# Altium project Solar_Panel_top_bot.PrjPcb
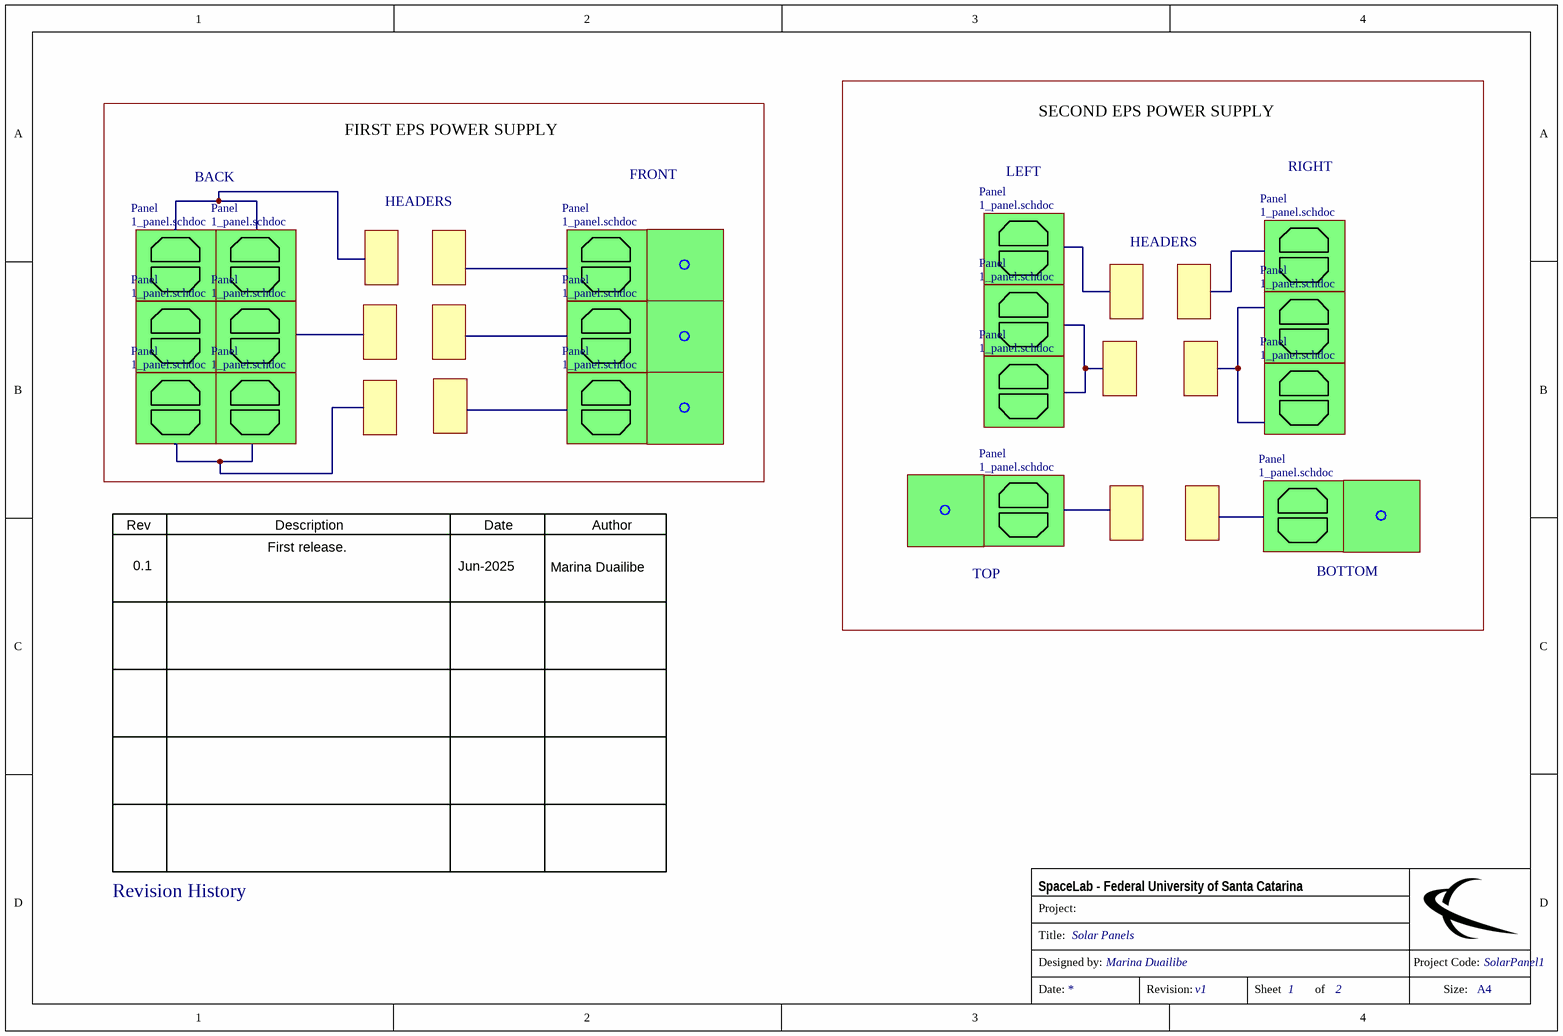
[diagram p0: 1_Architecture.schdoc]
DesignedBy: Marina Duailibe; ProjectCode: SolarPanel1; Revision: v1
2 sheets, 136 parts. Net scope: global (net labels, ports and power ports of the same name join across sheets).
Board file: PCB1.PcbDoc
Sheets:
  1_Architecture.schdoc
    Panel = 1_panel.schdoc
    Panel = 1_panel.schdoc
    Panel = 1_panel.schdoc
    Panel = 1_panel.schdoc
    Panel = 1_panel.schdoc
    Panel = 1_panel.schdoc
    Panel = 1_panel.schdoc
    Panel = 1_panel.schdoc
    Panel = 1_panel.schdoc
    Panel = 1_panel.schdoc
    Panel = 1_panel.schdoc
    Panel = 1_panel.schdoc
    Panel = 1_panel.schdoc
    Panel = 1_panel.schdoc
    Panel = 1_panel.schdoc
    Panel = 1_panel.schdoc
    Panel = 1_panel.schdoc

## Sheet 1_Architecture.schdoc: Solar Panels
size A4; Engineer: Eng_2_ALT; SheetNumber: 1; SheetTotal: 2; Designed by: Marina Duailibe; Version: v0.1; ProjectCode: SolarPanel1

### Sub-sheets
Panel = 1_panel.schdoc: no entries
Panel = 1_panel.schdoc: no entries
Panel = 1_panel.schdoc: no entries
Panel = 1_panel.schdoc: no entries
Panel = 1_panel.schdoc: no entries
Panel = 1_panel.schdoc: no entries
Panel = 1_panel.schdoc: no entries
Panel = 1_panel.schdoc: no entries
Panel = 1_panel.schdoc: no entries
Panel = 1_panel.schdoc: no entries
Panel = 1_panel.schdoc: no entries
Panel = 1_panel.schdoc: no entries
Panel = 1_panel.schdoc: no entries
Panel = 1_panel.schdoc: no entries
Panel = 1_panel.schdoc: no entries
Panel = 1_panel.schdoc: no entries
Panel = 1_panel.schdoc: no entries

### Notes on the sheet
- BACK
- FIRST EPS POWER SUPPLY
- FRONT
- LEFT
- SECOND EPS POWER SUPPLY
- RIGHT
- HEADERS
- Rev
- 0.1
- Description
- Jun-2025
- Date
- Marina Duailibe
- Author
- TOP
- BOTTOM
- First release.
- Revision History
- Project:
- SpaceLab - Federal University of Santa Catarina
- Title:
- Designed by:
- Project Code:
- Date:
- Revision:
- Sheet
- of
- Size:
- A4

## Sheet 1_panel.schdoc: Solar Cells
size A4; Engineer: Eng_2_ALT; SheetNumber: 2; SheetTotal: 2; Designed by: Marina Duailibe; Version: v0.1; ProjectCode: SolarPanel1
Used 17 times, as channels Panel, Panel, Panel, Panel, Panel, Panel, Panel, Panel, Panel, Panel, Panel, Panel, Panel, Panel, Panel, Panel, Panel. Parts and nets are listed once, with the designators drawn on the sheet.
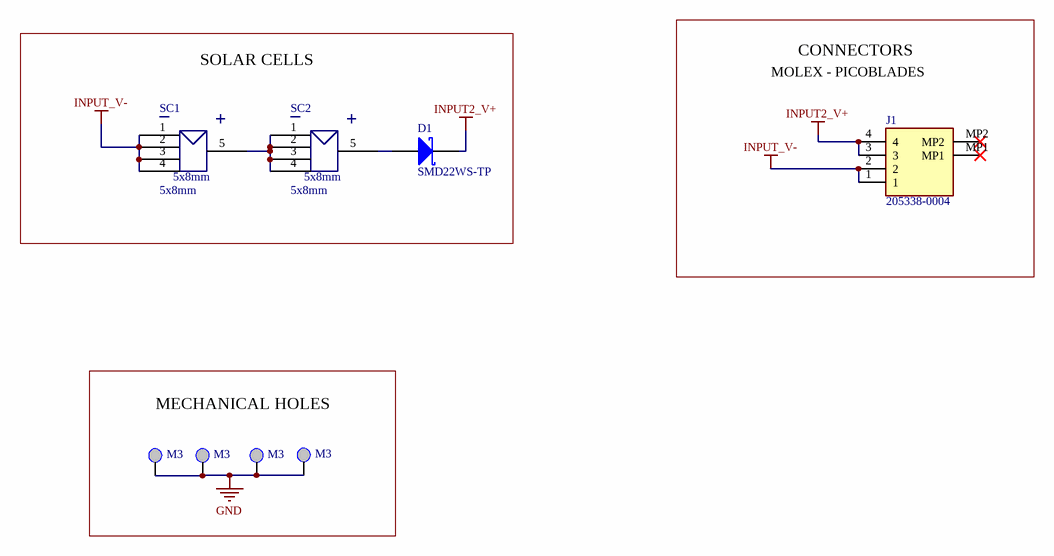
[diagram p1: 1_panel.schdoc]

### Parts
D1  SMD22WS-TP  [SOD323F]
J1  205338-0004  [MOLEX_4PIN_HEADER]
MEC1  M3  [HOLE6x6mm]  (no BOM)
MEC2  M3  [HOLE6x6mm]  (no BOM)
MEC3  M3  [HOLE6x6mm]  (no BOM)
MEC4  M3  [HOLE6x6mm]  (no BOM)
SC1  5x8mm  [SOLAR_CELL]
SC2  5x8mm  [SOLAR_CELL]

### Blocks framed on the sheet
CONNECTORS: J1
SOLAR CELLS: D1 SC1 SC2
MECHANICAL HOLES: MEC1-MEC4

### Nets
GND: MEC1.0 MEC2.0 MEC3.0 MEC4.0
INPUT2_V+: D1.1(K) J1.3 J1.4
INPUT_V-: J1.1 J1.2 SC1.1(V+) SC1.2(V-) SC1.3 SC1.4
NetD1_2: D1.2(A) SC2.5
NetSC1_5: SC1.5 SC2.1(V+) SC2.2(V-) SC2.3 SC2.4

Not connected (* = marked no-connect by the designer): J1 MP1* MP2*

### Channels
Panel: designators D1=D1_Panel#1 J1=J1 MEC1=MEC1_Panel#1 MEC2=MEC2_Panel#1 MEC3=MEC3_Panel#1 MEC4=MEC4_Panel#1 SC1=SC1_Panel#1 SC2=SC2_Panel#1
Panel: designators D1=D1_Panel#2 J1=J1_Panel#1 MEC1=MEC1_Panel#2 MEC2=MEC2_Panel#2 MEC3=MEC3_Panel#2 MEC4=MEC4_Panel#2 SC1=SC1_Panel#2 SC2=SC2_Panel#2
Panel: designators D1=D1_Panel#3 J1=J1_Panel#2 MEC1=MEC1_Panel#3 MEC2=MEC2_Panel#3 MEC3=MEC3_Panel#3 MEC4=MEC4_Panel#3 SC1=SC1_Panel#3 SC2=SC2_Panel#3
Panel: designators D1=D1_Panel#4 J1=J1_Panel#3 MEC1=MEC1_Panel#4 MEC2=MEC2_Panel#4 MEC3=MEC3_Panel#4 MEC4=MEC4_Panel#4 SC1=SC1_Panel#4 SC2=SC2_Panel#4
Panel: designators D1=D1_Panel#5 J1=J1_Panel#4 MEC1=MEC1_Panel#5 MEC2=MEC2_Panel#5 MEC3=MEC3_Panel#5 MEC4=MEC4_Panel#5 SC1=SC1_Panel#5 SC2=SC2_Panel#5
Panel: designators D1=D1_Panel#6 J1=J1_Panel#5 MEC1=MEC1_Panel#6 MEC2=MEC2_Panel#6 MEC3=MEC3_Panel#6 MEC4=MEC4_Panel#6 SC1=SC1_Panel#6 SC2=SC2_Panel#6
Panel: designators D1=D1_Panel#7 J1=J1_Panel#6 MEC1=MEC1_Panel#7 MEC2=MEC2_Panel#7 MEC3=MEC3_Panel#7 MEC4=MEC4_Panel#7 SC1=SC1_Panel#7 SC2=SC2_Panel#7
Panel: designators D1=D1_Panel#8 J1=J1_Panel#7 MEC1=MEC1_Panel#8 MEC2=MEC2_Panel#8 MEC3=MEC3_Panel#8 MEC4=MEC4_Panel#8 SC1=SC1_Panel#8 SC2=SC2_Panel#8
Panel: designators D1=D1_Panel#9 J1=J1_Panel#8 MEC1=MEC1_Panel#9 MEC2=MEC2_Panel#9 MEC3=MEC3_Panel#9 MEC4=MEC4_Panel#9 SC1=SC1_Panel#9 SC2=SC2_Panel#9
Panel: designators D1=D1_Panel#10 J1=J1_Panel#9 MEC1=MEC1_Panel#10 MEC2=MEC2_Panel#10 MEC3=MEC3_Panel#10 MEC4=MEC4_Panel#10 SC1=SC1_Panel#10 SC2=SC2_Panel#10
Panel: designators D1=D1_Panel#11 J1=J1_Panel#10 MEC1=MEC1_Panel#11 MEC2=MEC2_Panel#11 MEC3=MEC3_Panel#11 MEC4=MEC4_Panel#11 SC1=SC1_Panel#11 SC2=SC2_Panel#11
Panel: designators D1=D1_Panel#12 J1=J1_Panel#11 MEC1=MEC1_Panel#12 MEC2=MEC2_Panel#12 MEC3=MEC3_Panel#12 MEC4=MEC4_Panel#12 SC1=SC1_Panel#12 SC2=SC2_Panel#12
Panel: designators D1=D1_Panel#13 J1=J1_Panel#12 MEC1=MEC1_Panel#13 MEC2=MEC2_Panel#13 MEC3=MEC3_Panel#13 MEC4=MEC4_Panel#13 SC1=SC1_Panel#13 SC2=SC2_Panel#13
Panel: designators D1=D1_Panel#14 J1=J1_Panel#13 MEC1=MEC1_Panel#14 MEC2=MEC2_Panel#14 MEC3=MEC3_Panel#14 MEC4=MEC4_Panel#14 SC1=SC1_Panel#14 SC2=SC2_Panel#14
Panel: designators D1=D1_Panel#15 J1=J1_Panel#14 MEC1=MEC1_Panel#15 MEC2=MEC2_Panel#15 MEC3=MEC3_Panel#15 MEC4=MEC4_Panel#15 SC1=SC1_Panel#15 SC2=SC2_Panel#15
Panel: designators D1=D1_Panel#16 J1=J1_Panel#15 MEC1=MEC1_Panel#16 MEC2=MEC2_Panel#16 MEC3=MEC3_Panel#16 MEC4=MEC4_Panel#16 SC1=SC1_Panel#16 SC2=SC2_Panel#16
Panel: designators D1=D1_Panel#17 J1=J1_Panel#16 MEC1=MEC1_Panel#17 MEC2=MEC2_Panel#17 MEC3=MEC3_Panel#17 MEC4=MEC4_Panel#17 SC1=SC1_Panel#17 SC2=SC2_Panel#17

### Notes on the sheet
- MOLEX - PICOBLADES
- Project:
- SpaceLab - Federal University of Santa Catarina
- Title:
- Designed by:
- Project Code:
- Date:
- Revision:
- Sheet
- of
- Size:
- A4
- (in symbol SOLAR CELL) _; +

### Library data of the parts
D1 = DIODE_SCHOTTKY_20V_2A_SMD22WS-TP: Diode Schottky 20 V 2A Surface Mount SOD-323; Partnumber: SMD22WS-TP
J1 = 205338-0004: Connector; Manufacturer_Name: Molex; Datasheet Link: https://www.molex.com/pdm_docs/sd/2053380004_sd.pdf; Height: 2.8mm; Manufacturer_Part_Number: 205338-0004; Mouser Part Number: 538-205338-0004; Mouser Price/Stock: https://www.mouser.co.uk/ProductDetail/Molex/205338-0004?qs=GedFDFLaBXGldxOQTm%2FukQ%3D%3D
MEC1-MEC4 = M3 hole
SC1 SC2 = SOLAR CELL: Manufacturer: Yim Space; PDM Number: SC-3GA-3

## Nets that join several sheets
GND: Panel (MEC1_Panel#1.0 MEC2_Panel#1.0 MEC3_Panel#1.0 MEC4_Panel#1.0), Panel (MEC1_Panel#2.0 MEC2_Panel#2.0 MEC3_Panel#2.0 MEC4_Panel#2.0), Panel (MEC1_Panel#3.0 MEC2_Panel#3.0 MEC3_Panel#3.0 MEC4_Panel#3.0), Panel (MEC1_Panel#4.0 MEC2_Panel#4.0 MEC3_Panel#4.0 MEC4_Panel#4.0), Panel (MEC1_Panel#5.0 MEC2_Panel#5.0 MEC3_Panel#5.0 MEC4_Panel#5.0), Panel (MEC1_Panel#6.0 MEC2_Panel#6.0 MEC3_Panel#6.0 MEC4_Panel#6.0), Panel (MEC1_Panel#7.0 MEC2_Panel#7.0 MEC3_Panel#7.0 MEC4_Panel#7.0), Panel (MEC1_Panel#8.0 MEC2_Panel#8.0 MEC3_Panel#8.0 MEC4_Panel#8.0), Panel (MEC1_Panel#9.0 MEC2_Panel#9.0 MEC3_Panel#9.0 MEC4_Panel#9.0), Panel (MEC1_Panel#10.0 MEC2_Panel#10.0 MEC3_Panel#10.0 MEC4_Panel#10.0), Panel (MEC1_Panel#11.0 MEC2_Panel#11.0 MEC3_Panel#11.0 MEC4_Panel#11.0), Panel (MEC1_Panel#12.0 MEC2_Panel#12.0 MEC3_Panel#12.0 MEC4_Panel#12.0), Panel (MEC1_Panel#13.0 MEC2_Panel#13.0 MEC3_Panel#13.0 MEC4_Panel#13.0), Panel (MEC1_Panel#14.0 MEC2_Panel#14.0 MEC3_Panel#14.0 MEC4_Panel#14.0), Panel (MEC1_Panel#15.0 MEC2_Panel#15.0 MEC3_Panel#15.0 MEC4_Panel#15.0), Panel (MEC1_Panel#16.0 MEC2_Panel#16.0 MEC3_Panel#16.0 MEC4_Panel#16.0), Panel (MEC1_Panel#17.0 MEC2_Panel#17.0 MEC3_Panel#17.0 MEC4_Panel#17.0)
INPUT2_V+: Panel (D1_Panel#1.1 J1.3 J1.4), Panel (D1_Panel#2.1 J1_Panel#1.3 J1_Panel#1.4), Panel (D1_Panel#3.1 J1_Panel#2.3 J1_Panel#2.4), Panel (D1_Panel#4.1 J1_Panel#3.3 J1_Panel#3.4), Panel (D1_Panel#5.1 J1_Panel#4.3 J1_Panel#4.4), Panel (D1_Panel#6.1 J1_Panel#5.3 J1_Panel#5.4), Panel (D1_Panel#7.1 J1_Panel#6.3 J1_Panel#6.4), Panel (D1_Panel#8.1 J1_Panel#7.3 J1_Panel#7.4), Panel (D1_Panel#9.1 J1_Panel#8.3 J1_Panel#8.4), Panel (D1_Panel#10.1 J1_Panel#9.3 J1_Panel#9.4), Panel (D1_Panel#11.1 J1_Panel#10.3 J1_Panel#10.4), Panel (D1_Panel#12.1 J1_Panel#11.3 J1_Panel#11.4), Panel (D1_Panel#13.1 J1_Panel#12.3 J1_Panel#12.4), Panel (D1_Panel#14.1 J1_Panel#13.3 J1_Panel#13.4), Panel (D1_Panel#15.1 J1_Panel#14.3 J1_Panel#14.4), Panel (D1_Panel#16.1 J1_Panel#15.3 J1_Panel#15.4), Panel (D1_Panel#17.1 J1_Panel#16.3 J1_Panel#16.4)
INPUT_V-: Panel (6 pins), Panel (6 pins), Panel (6 pins), Panel (6 pins), Panel (6 pins), Panel (6 pins), Panel (6 pins), Panel (6 pins), Panel (6 pins), Panel (6 pins), Panel (6 pins), Panel (6 pins), Panel (6 pins), Panel (6 pins), Panel (6 pins), Panel (6 pins), Panel (6 pins)